# EAGLE schematic Ublox (EAGLE 6.5.0)
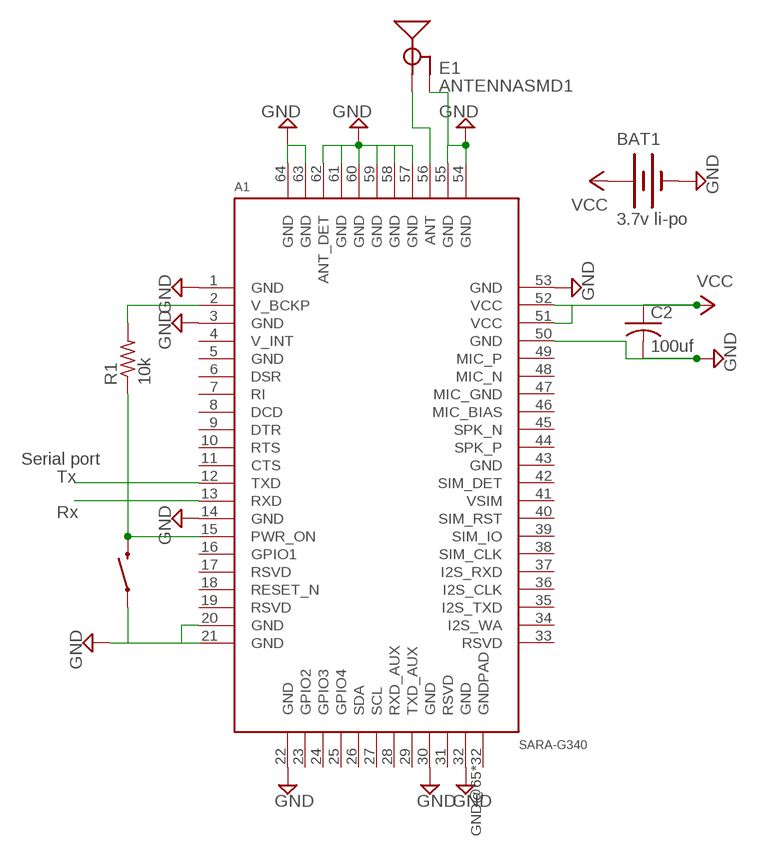
[diagram p0: schematic, sheet 1]

## Parts
A1  SARA-G340  [SARA]
BAT1  3.7v li-po  BATTERY9V  [BATTCON_9V]
C2  100uf  C-US025-024X044  [C025-024X044]
E1  ANTENNASMD1  [ANTENNA-CHIP]
R1  10k  FLIPFLOP-RES  [0805-THM]
S2  SWITCH-MOMENTARY-2PTH  [TACTILE-PTH]

## Nets
GND: A1.1(GND) A1.3(GND) A1.14(GND) A1.20(GND) A1.21(GND) A1.22(GND) A1.30(GND) A1.32(GND) A1.50(GND) A1.53(GND) A1.54(GND) A1.55(GND) A1.57(GND) A1.58(GND) A1.59(GND) A1.60(GND) A1.61(GND) A1.62(ANT_DET) A1.63(GND) A1.64(GND) BAT1.- C2.2 E1.GND S2.1
N$1: A1.56(ANT) E1.FEED(SIGNAL)
N$2: A1.15(PWR_ON) R1.1 S2.3
N$3: A1.2(V_BCKP) R1.2
N$4: A1.12(TXD)
N$5: A1.13(RXD)
VCC: A1.51(VCC) A1.52(VCC) BAT1.+ C2.1
Unconnected: A1.4(V_INT) A1.5(GND) A1.6(DSR) A1.7(RI) A1.8(DCD) A1.9(DTR) A1.10(RTS) A1.11(CTS) A1.16(GPIO1) A1.17(RSVD) A1.18(RESET_N) A1.19(RSVD) A1.23(GPIO2) A1.24(GPIO3) A1.25(GPIO4) A1.26(SDA) A1.27(SCL) A1.28(RXD_AUX) A1.29(TXD_AUX) A1.31(RSVD) A1.33(RSVD) A1.34(I2S_WA) A1.35(I2S_TXD) A1.36(I2S_CLK) A1.37(I2S_RXD) A1.38(SIM_CLK) A1.39(SIM_IO) A1.40(SIM_RST) A1.41(VSIM) A1.42(SIM_DET) A1.43(GND) A1.44(SPK_P) A1.45(SPK_N) A1.46(MIC_BIAS) A1.47(MIC_GND) A1.48(MIC_N) A1.49(MIC_P) A1.GND@65(GNDPAD) A1.GND@66(GNDPAD) A1.GND@67(GNDPAD) A1.GND@68(GNDPAD) A1.GND@69(GNDPAD) A1.GND@70(GNDPAD) A1.GND@71(GNDPAD) A1.GND@72(GNDPAD) A1.GND@73(GNDPAD) A1.GND@74(GNDPAD) A1.GND@75(GNDPAD) A1.GND@76(GNDPAD) A1.GND@77(GNDPAD) A1.GND@78(GNDPAD) A1.GND@79(GNDPAD) A1.GND@80(GNDPAD) A1.GND@81(GNDPAD) A1.GND@82(GNDPAD) A1.GND@83(GNDPAD) A1.GND@84(GNDPAD) A1.GND@85(GNDPAD) A1.GND@86(GNDPAD) A1.GND@87(GNDPAD) A1.GND@88(GNDPAD) A1.GND@89(GNDPAD) A1.GND@90(GNDPAD) A1.GND@91(GNDPAD) A1.GND@92(GNDPAD) A1.GND@93(GNDPAD) A1.GND@94(GNDPAD) A1.GND@95(GNDPAD) A1.GND@96(GNDPAD)

## Notes on the sheet
- Serial port
- Tx
- Rx

## Library data of the parts
A1 = Ublox:SARA-G3
BAT1 = SparkFun-Electromechanical:BATTERY: Battery Holders Various common sizes : AA, AAA, 18650 (PRT-12895), 20mm coin cell and 12mm coin cell. 20MM_4LEGS, BATT-10373
C2 = adafruit:C-US: CAPACITOR, American symbol
E1 = SparkFun-RF:ANTENNA: Chip antenna Chip antenna with ground or secondary connection. Common with larger metal RF connectors.
R1 = adafruit:FLIPFLOP-RES: Flip Flop resistor An 0805 resistor inside a standard 1/4W 5% resistor. Makes for easy mods
S2 = SparkFun-Electromechanical:SWITCH-MOMENTARY-2: Various NO switches- pushbuttons, reed, etc; PROD_ID: SWCH-08441